# Altium schematic sheet MCU.SchDoc
size Tabloid; CompanyName: Ploopy Corporation; Organization: Ploopy Corporation; Address1: 137-1140 Burnhamthorpe Road W; Address2: Mississauga; Address3: Ontario; Address4: Canada L5C 0A3; DocumentNumber: 5; Revision: R2.002; SheetNumber: 5; SheetTotal: 8
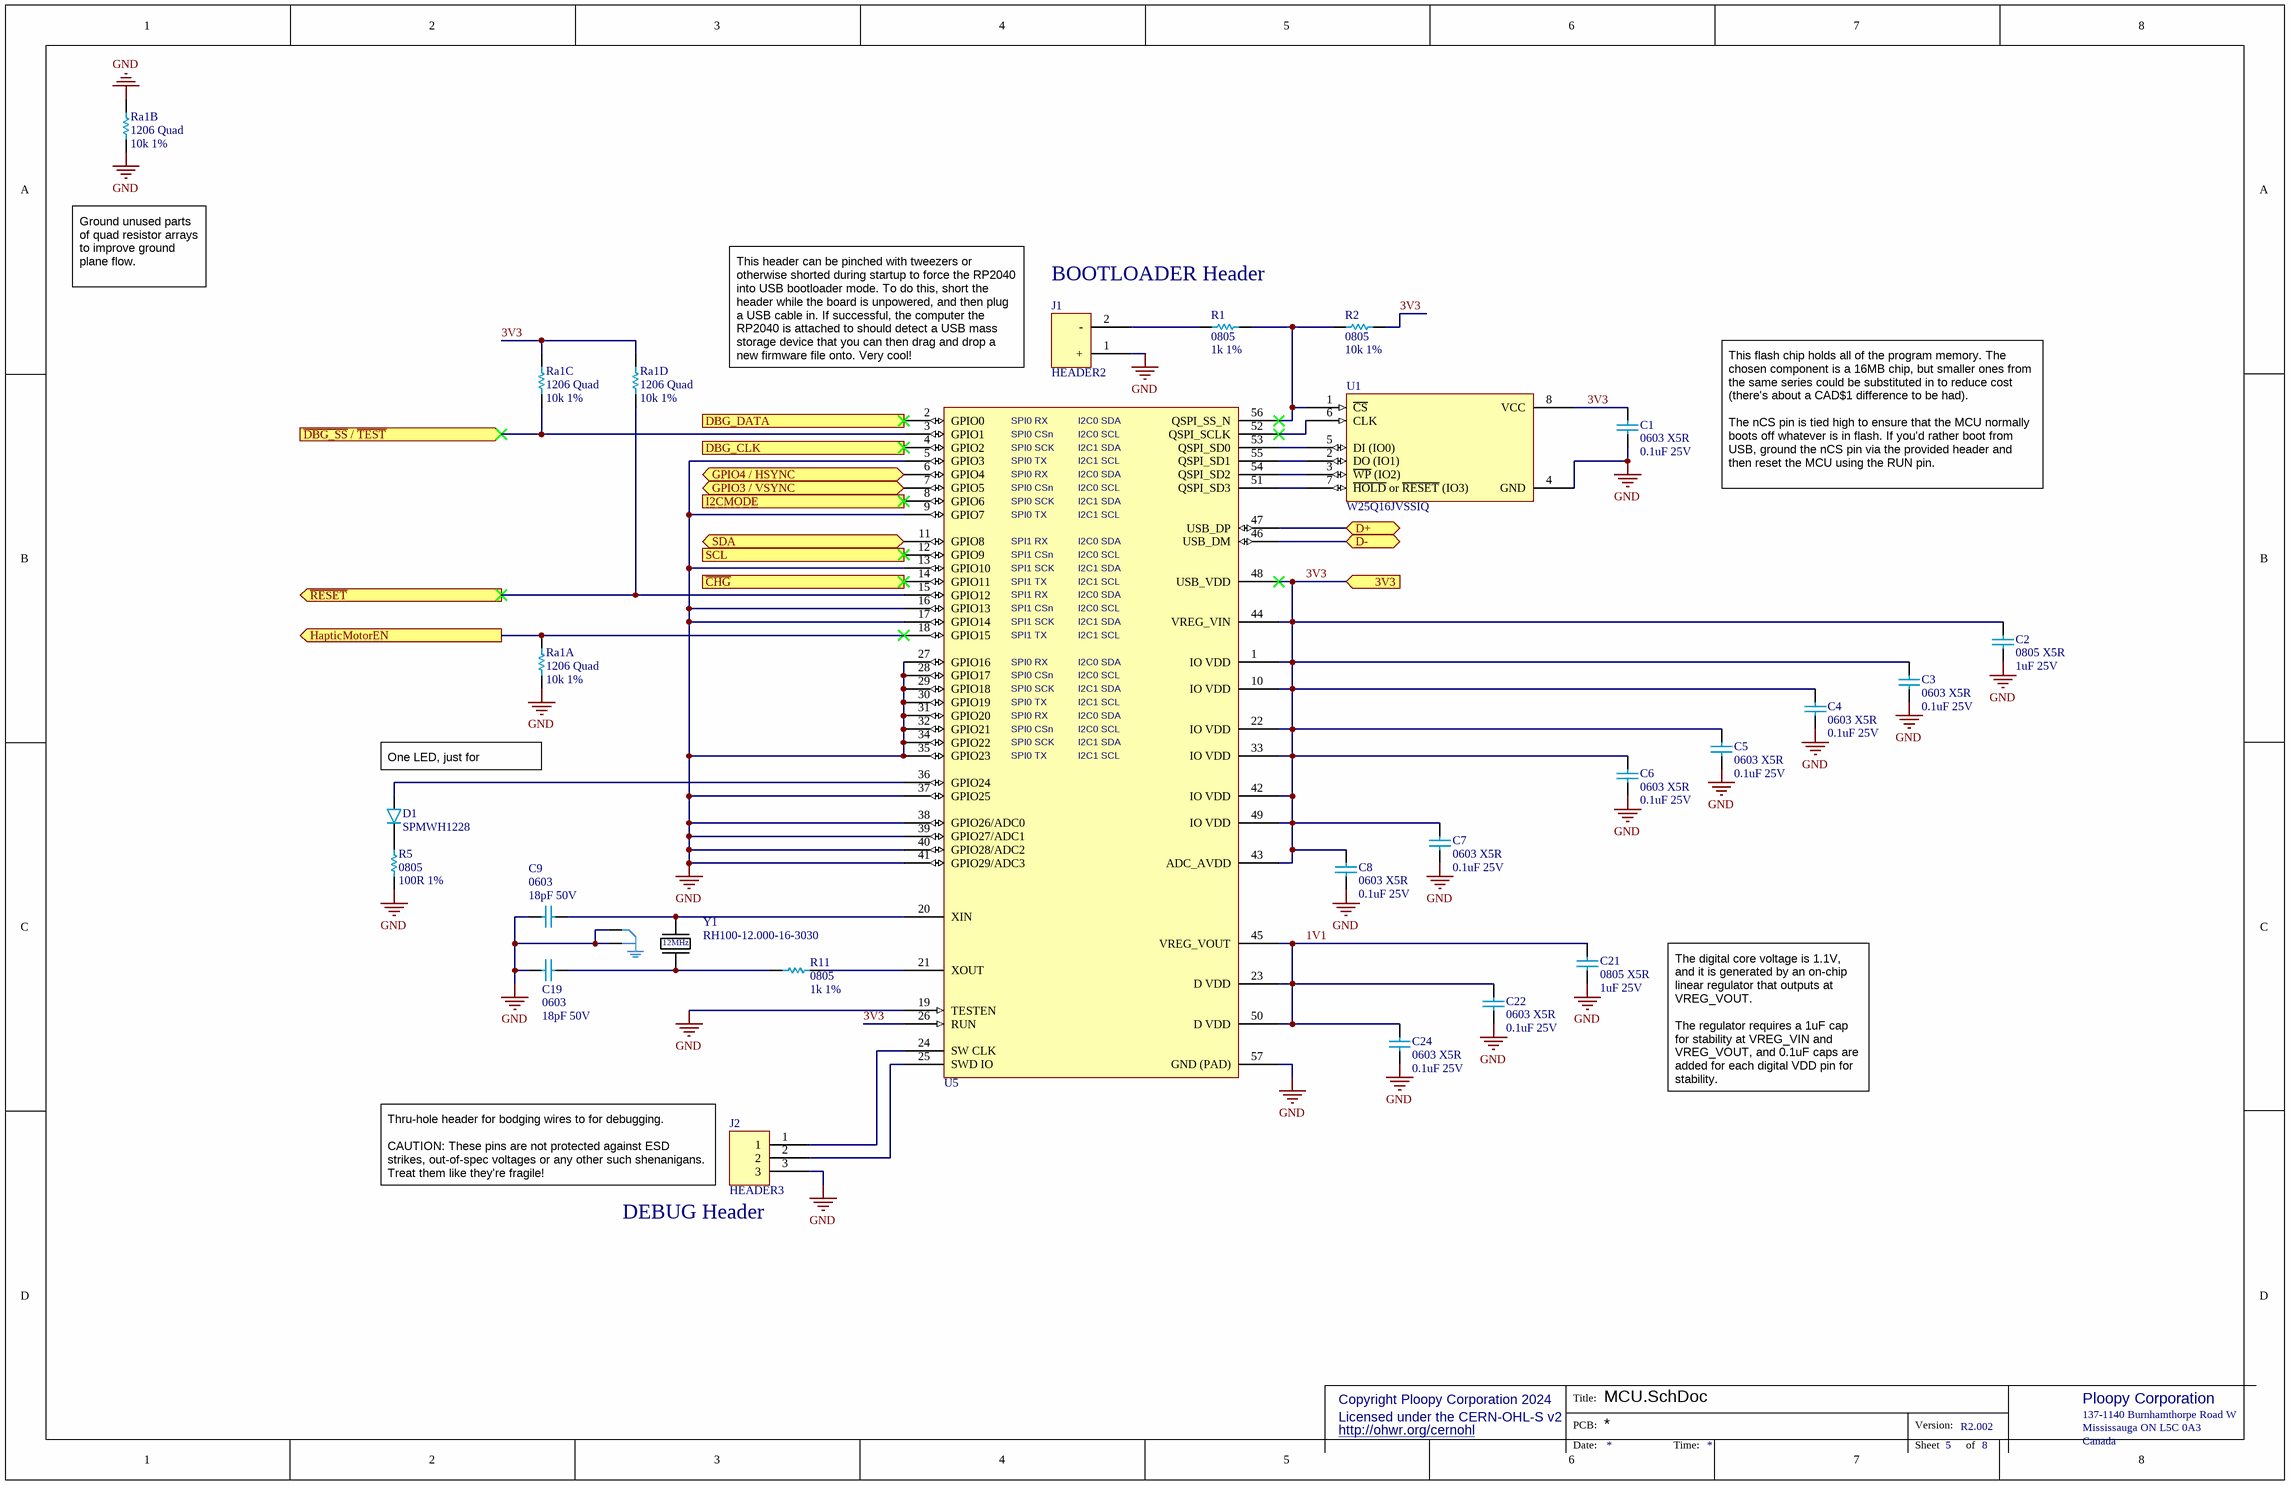
[diagram p0: MCU.SchDoc]

## Parts
C1  0603 X5R  value 0.1uF 25V  [0603 capacitor - CAPC1608X06N]
C2  0805 X5R  value 1uF 25V  [0805 - TALL]
C3  0603 X5R  value 0.1uF 25V  [0603 capacitor - CAPC1608X06N]
C4  0603 X5R  value 0.1uF 25V  [0603 capacitor - CAPC1608X06N]
C5  0603 X5R  value 0.1uF 25V  [0603 capacitor - CAPC1608X06N]
C6  0603 X5R  value 0.1uF 25V  [0603 capacitor - CAPC1608X06N]
C7  0603 X5R  value 0.1uF 25V  [0603 capacitor - CAPC1608X06N]
C8  0603 X5R  value 0.1uF 25V  [0603 capacitor - CAPC1608X06N]
C9  0603  value 18pF 50V  [0603 capacitor - CAPC1608X06N]
C19  0603  value 18pF 50V  [0603 capacitor - CAPC1608X06N]
C21  0805 X5R  value 1uF 25V  [0805 - TALL]
C22  0603 X5R  value 0.1uF 25V  [0603 capacitor - CAPC1608X06N]
C24  0603 X5R  value 0.1uF 25V  [0603 capacitor - CAPC1608X06N]
D1  SPMWH1228  [SPMWH1228]
J1  HEADER2  [2x1]
J2  HEADER3  [3x1]
R1  0805  value 1k 1%  [0805]
R2  0805  value 10k 1%  [0805]
R5  0805  value 100R 1%  [0805]
R11  0805  value 1k 1%  [0805]
Ra1  1206 Quad  value 10k 1%  [4x 10k 1% - CAC-80P320X160-8M]  (parts A,B,C,D of 4)
U1  W25Q16JVSSIQ  [W25Q128JVS - SOIC127P790X216-8M]
U5  RP2040  [RP2040 - QFN40P700X700X90_HS-57M]  (value not drawn)
Y1  RH100-12.000-16-3030  [RH100-12.000-16-3030]

## Ports
3V3 (in), D+ (bidir), D- (bidir), DBG_CLK (in), DBG_DATA (in), GPIO3 / VSYNC (bidir), GPIO4 / HSYNC (bidir), HapticMotorEN (out), I2CMODE (out), SCL (out), SDA (bidir), ~{CHG} (in), ~{DBG_SS} / ~{TEST} (in), ~{RESET} (out)

## Nets
GND: C1.1 C2.1 C3.1 C4.1 C5.1 C6.1 C7.1 C8.1 C9.2 C19.1 C21.1 C22.1 C24.1 J1.1(+) J2.3 R5.1 Ra1.2 Ra1.7 Ra1.8 U1.4(GND) U5.5(GPIO3) U5.9(GPIO7) U5.13(GPIO10) U5.16(GPIO13) U5.17(GPIO14) U5.19(TESTEN) U5.27(GPIO16) U5.28(GPIO17) U5.29(GPIO18) U5.30(GPIO19) U5.31(GPIO20) U5.32(GPIO21) U5.34(GPIO22) U5.35(GPIO23) U5.37(GPIO25) U5.38(GPIO26/ADC0) U5.39(GPIO27/ADC1) U5.40(GPIO28/ADC2) U5.41(GPIO29/ADC3) U5.57(GND_(PAD)) Y1.2 Y1.4
1V1: C21.2 C22.2 C24.2 U5.23(D_VDD) U5.45(VREG_VOUT) U5.50(D_VDD)
3V3: C1.2 C2.2 C3.2 C4.2 C5.2 C6.2 C7.2 C8.2 R2.1 Ra1.5 Ra1.6 U1.8(VCC) U5.1(IO_VDD) U5.10(IO_VDD) U5.22(IO_VDD) U5.26(RUN) U5.33(IO_VDD) U5.42(IO_VDD) U5.43(ADC_AVDD) U5.44(VREG_VIN) U5.48(USB_VDD) U5.49(IO_VDD) ; port 3V3
~{CHG}: U5.14(GPIO11) ; port ~{CHG}
D+: U5.47(USB_DP) ; port D+
D-: U5.46(USB_DM) ; port D-
~{DBG_SS} / ~{TEST}: Ra1.3 U5.3(GPIO1) ; port ~{DBG_SS} / ~{TEST}
DBG_CLK: U5.4(GPIO2) ; port DBG_CLK
DBG_DATA: U5.2(GPIO0) ; port DBG_DATA
GPIO3 / VSYNC: U5.7(GPIO5) ; port GPIO3 / VSYNC
GPIO4 / HSYNC: U5.6(GPIO4) ; port GPIO4 / HSYNC
HapticMotorEN: Ra1.1 U5.18(GPIO15) ; port HapticMotorEN
I2CMODE: U5.8(GPIO6) ; port I2CMODE
~{RESET}: Ra1.4 U5.15(GPIO12) ; port ~{RESET}
SCL: U5.12(GPIO9) ; port SCL
SDA: U5.11(GPIO8) ; port SDA
NetC9_1: C9.1 U5.20(XIN) Y1.1
NetC19_2: C19.2 R11.2 Y1.3
NetD1_1: D1.1(A) U5.36(GPIO24)
NetD1_2: D1.2(C) R5.2
NetJ1_2: J1.2(-) R1.1
NetJ2_1: J2.1 U5.24(SW_CLK)
NetJ2_2: J2.2 U5.25(SWD_IO)
NetR1_2: R1.2 R2.2 U1.1(~{CS}) U5.56(QSPI_SS_N)
NetR11_1: R11.1 U5.21(XOUT)
NetU1_2: U1.2(DO_(IO1)) U5.55(QSPI_SD1)
NetU1_3: U1.3(~{WP}_(IO2)) U5.54(QSPI_SD2)
NetU1_5: U1.5(DI_(IO0)) U5.53(QSPI_SD0)
NetU1_6: U1.6(CLK) U5.52(QSPI_SCLK)
NetU1_7: U1.7(~{HOLD}_or_~{RESET}_(IO3)) U5.51(QSPI_SD3)

## Notes on the sheet
- Ground unused parts of quad resistor arrays to improve ground plane flow.
- BOOTLOADER Header
- This header can be pinched with tweezers or otherwise shorted during startup to force the RP2040 into USB bootloader mode. To do this, short the header while the board is unpowered, and then plug a USB cable in. If successful, the computer the RP2040 is attached to should detect a USB mass storage device that you can then drag and drop a new firmware file onto. Very cool!
- This flash chip holds all of the program memory. The chosen component is a 16MB chip, but smaller ones from the same series could be substituted in to reduce cost (there's about a CAD$1 difference to be had).
  The nCS pin is tied high to ensure that the MCU normally boots off whatever is in flash. If you'd rather boot from USB, ground the nCS pin via the provided header and then reset the MCU using the RUN pin.
- (near D1) One LED, just for debugging.
- The digital core voltage is 1.1V, and it is generated by an on-chip linear regulator that outputs at VREG_VOUT.
  The regulator requires a 1uF cap for stability at VREG_VIN and VREG_VOUT, and 0.1uF caps are added for each digital VDD pin for stability.
- Thru-hole header for bodging wires to for debugging.
  CAUTION: These pins are not protected against ESD strikes, out-of-spec voltages or any other such shenanigans. Treat them like they're fragile!
- (near J2) DEBUG Header
- Copyright Ploopy Corporation 2024
- Licensed under the CERN-OHL-S v2
- http://ohwr.org/cernohl
- Title:
- PCB:
- Version:
- Ploopy Corporation
- Mississauga ON L5C 0A3
- 137-1140 Burnhamthorpe Road W
- Date:
- Time:
- Sheet
- of
- Canada
- (in symbol RH100-12.000-16-3030) 12MHz
- (in symbol RP2040) SPI0 RX; I2C0 SDA; SPI0 CSn; I2C0 SCL; SPI0 SCK; I2C1 SDA; SPI0 TX; I2C1 SCL; SPI1 RX; SPI1 CSn; SPI1 SCK; SPI1 TX

## Library data of the parts
C1 C3-C8 C22 C24 = Cap 0.1uF 25V: 0603, X5R or better; Supplier 1: Digi-Key; Supplier Part Number 1: 1276-6840-2-ND
C2 C21 = Cap 1uF 25V: 0805, X5R or better; Supplier 1: Digi-Key; Supplier Part Number 1: 1276-1066-2-ND; Supplier 2: Digi-Key; Supplier Part Number 2: 1276-1066-1-ND
C9 C19 = Cap 18pF 50V: 0603, C0G or better; Supplier 1: Digi-Key; Supplier Part Number 1: 1292-1494-1-ND
D1 = SPMWH1228: 3V/0.5W white LED, 2.8mm x 3.5mm; Supplier 2: Digi-Key; Supplier Part Number 2: 1510-1428-1-ND; Supplier 3: Digi-Key; Supplier Part Number 3: 1510-1429-1-ND; Supplier 1: Arrow
J1 = HEADER2: 2-pin 0.100" header; Supplier 1: Mouser; Supplier Part Number 1: 855-M20-9990245; Supplier 2: Digi-Key; Supplier Part Number 2: 952-2261-ND
J2 = HEADER3: 3-pin 0.100" header
R1 R11 = Res 1k 1% 0805: Chip resistor, 1/8W 100PPM; Supplier 1: Digi-Key; Supplier Part Number 1: RMCF0805FT1K00TR-ND
R2 = Res 10k 1% 0805: Chip resistor; Supplier 1: Digi-Key; Supplier Part Number 1: RMCF0805FT10K0TR-ND
R5 = Res 100R 1% 0805: Chip resistor; Supplier 1: Digi-Key; Supplier 2: Digi-Key; Supplier Part Number 1: RMCF0805FT100RCT-ND; Supplier Part Number 2: RMCF0805FT100RTR-ND
Ra1 = Quad Res 10k 1% 1206: Chip resistor
Y1 = RH100-12.000-16-3030: 12MHz Crystal 16pF 100 Ohms 4-SMD, No Lead (3.2mm x 2.5mm); Supplier 1: Digi-Key; Supplier 2: Mouser; Supplier Part Number 1: XC2686CT-ND; Supplier Part Number 2: 520-160-12-30B-AGMT
U1 = W25Q16JVSSIQ: Supplier 1: Digi-Key; Supplier Part Number 1: W25Q16JVSSIQ-ND
U5 = RP2040: Supplier 1: Newark; Supplier Part Number 1: 49AJ8740